# Altium project 2026MM.PrjPcb (part 10 of 10)
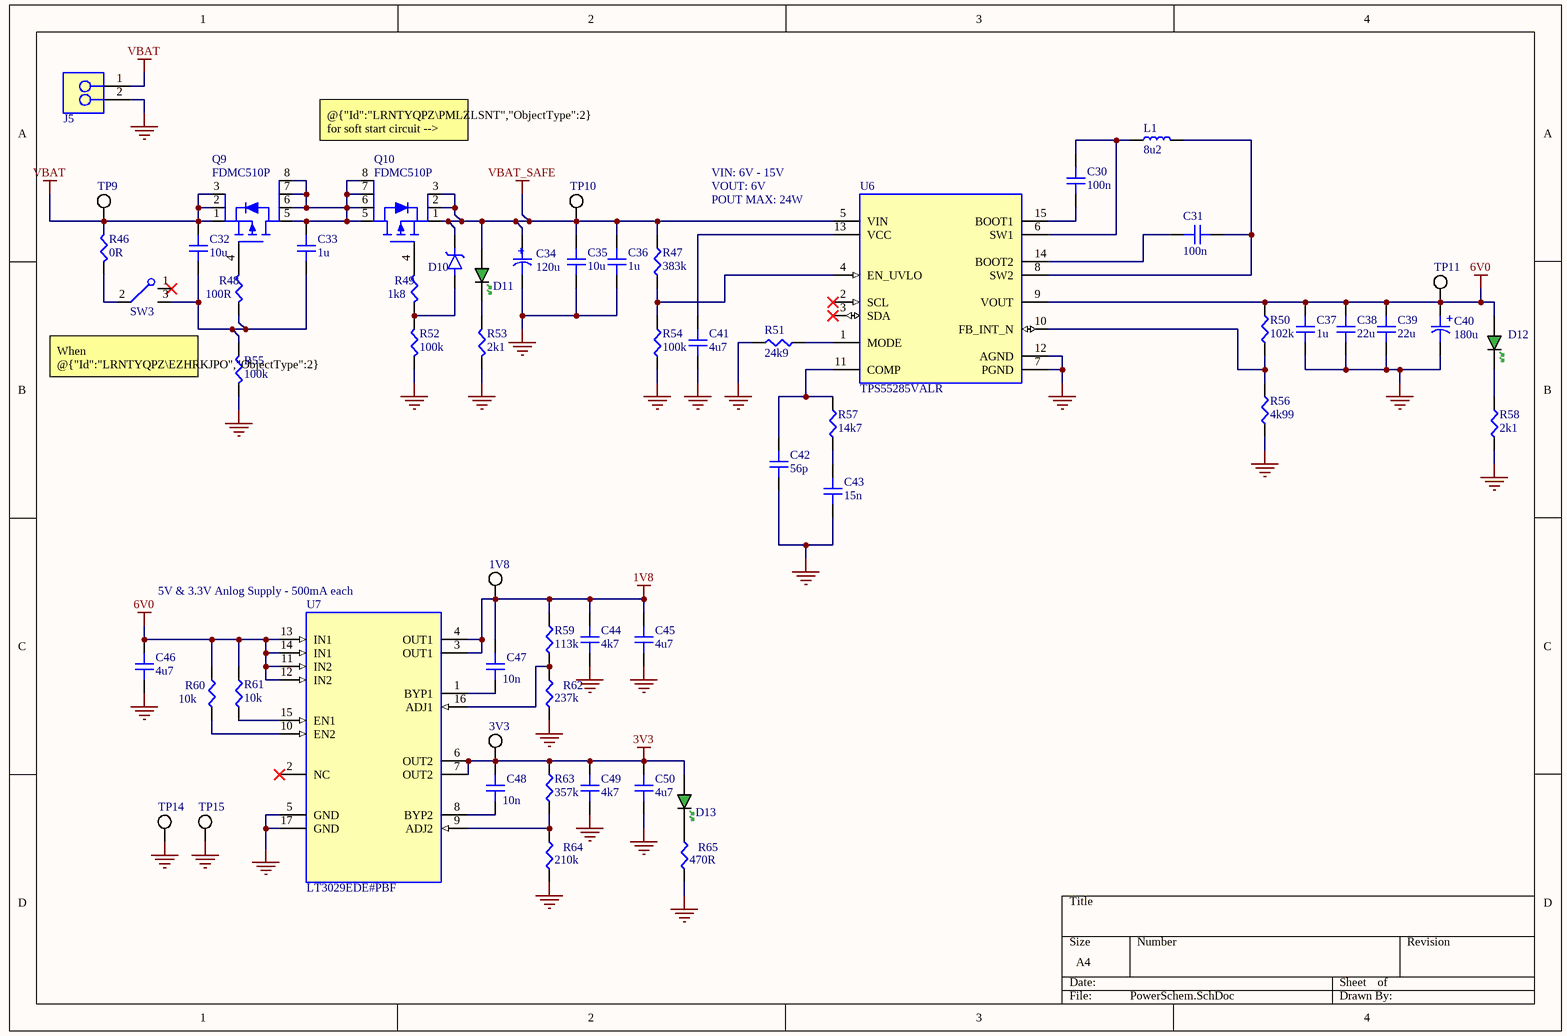
[diagram p10: PowerSchem.SchDoc]

## Sheet PowerSchem.SchDoc (continued)

### Library data of the parts (continued)
R60 R61 = RES: 100mW Thick Film Resistors ±100ppm/℃ ±1% 10kΩ 0603 Chip Resistor - Surface Mount ROHS; Manufacturer: Yageo Group; Manufacturer Part Number: RC0603FR-0710KL; Temperature Coefficient: 100ppm/°C; Voltage Rating: 75V; Voltage Rating (DC): 50V; Value: 10k; Supplier 1: Avnet; Supplier Part Number 1: RC0603FR-0710KL; RoHS: Compliant; Category: Chip SMD Resistors; Stock: 2520000; Pricing: 5000=0.00136, 10000=0.00132, 20000=0.00129, 40000=0.00126, 80000=0.00123 (USD); Case/Package: 0603; Case Code (Imperial): 0603; Case Code (Metric): 0603; China RoHS: Non-Compliant; Composition: Thick Film; Contact Plating: Tin; Depth: 800µm; Height: 450µm; Lead Free: Lead Free; Lead Pitch: 300µm; Length: 1.6mm; Lifecycle Status: Production; Max Operating Temperature: 155°C; Military Standard: Not; Min Operating Temperature: -55°C; Mounting Technology: Surface Mount; Pins: 2; Number of Terminals: 2; Packaging: Tape & Reel; Power Rating: 100mW; Radiation Hardening: No; REACH SVHC: Yes; Schedule B: 8533210045, 8533210045|8533210045|8533210045|8533210045|8533210045|8533210045|8533210045|8533210045|8533210045|8533210045|8533210045|8533210045|8533210045|8533210045|8533210045|8533210045|8533210045|8533210045|8533210045|8533210045|8533210045|8533210045|8533210045|85; Termination: SMD/SMT; Tolerance: 1%; Weight: 2.012816mg; Width: 800µm; Working Voltage: 75V; ComponentLink1URL: https://datasheet.octopart.com:443/RC0603FR-0710KL-Yageo-datasheet-175887523.pdf?src-supplier=IHS; ComponentLink1Description: https://datasheet.octopart.com:443/RC0603FR-0710KL-Yageo-datasheet-175887523.pdf?src-supplier=IHS; ComponentLink2URL: https://datasheet.octopart.com:443/RC0603FR-0710KL-Yageo-datasheet-103092701.pdf?src-supplier=Upverter; ComponentLink2Description: https://datasheet.octopart.com:443/RC0603FR-0710KL-Yageo-datasheet-103092701.pdf?src-supplier=Upverter; ComponentLink3URL: https://datasheet.octopart.com:443/RC0603FR-0710KL-Yageo-datasheet-98239111.pdf?src-supplier=Upverter; ComponentLink3Description: https://datasheet.octopart.com:443/RC0603FR-0710KL-Yageo-datasheet-98239111.pdf?src-supplier=Upverter; ComponentLink4URL: https://datasheet.octopart.com:443/RC0603FR-0710KL-Yageo-datasheet-141265859.pdf?src-supplier=Upverter; ComponentLink4Description: https://datasheet.octopart.com:443/RC0603FR-0710KL-Yageo-datasheet-141265859.pdf?src-supplier=Upverter; ComponentLink5URL: https://sigma.octopart.com:443/138820526/technical_drawing/Yageo-RC0603FR-0710KL.pdf?src-supplier=Upverter; ComponentLink5Description: https://sigma.octopart.com:443/138820526/technical_drawing/Yageo-RC0603FR-0710KL.pdf?src-supplier=Upverter; ComponentLink6URL: https://datasheet.octopart.com:443/RC0603FR-0710KL-Yageo-datasheet-8328172.pdf?src-supplier=Farnell; ComponentLink6Description: https://datasheet.octopart.com:443/RC0603FR-0710KL-Yageo-datasheet-8328172.pdf?src-supplier=Farnell; ComponentLink7URL: https://datasheet.octopart.com:443/RC0603FR-0710KL-Yageo-datasheet-13691069.pdf?src-supplier=Farnell; ComponentLink7Description: https://datasheet.octopart.com:443/RC0603FR-0710KL-Yageo-datasheet-13691069.pdf?src-supplier=Farnell; ComponentLink8URL: https://datasheet.octopart.com:443/RC0603FR-0710KL-Yageo-datasheet-62067350.pdf?src-supplier=element14+APAC; ComponentLink8Description: https://datasheet.octopart.com:443/RC0603FR-0710KL-Yageo-datasheet-62067350.pdf?src-supplier=element14+APAC; ComponentLink9URL: https://datasheet.octopart.com:443/RC0603FR-0710KL-Yageo-datasheet-17842380.pdf?src-supplier=element14+APAC; ComponentLink9Description: https://datasheet.octopart.com:443/RC0603FR-0710KL-Yageo-datasheet-17842380.pdf?src-supplier=element14+APAC; ComponentLink10URL: https://datasheet.octopart.com:443/RC0603FR-0710KL-Yageo-datasheet-15599030.pdf?src-supplier=Future+Electronics; ComponentLink10Description: https://datasheet.octopart.com:443/RC0603FR-0710KL-Yageo-datasheet-15599030.pdf?src-supplier=Future+Electronics; ComponentLink11URL: https://datasheet.octopart.com:443/RC0603FR-0710KL-Yageo-Group-datasheet-176638170.pdf?src-supplier=Future+Electronics; ComponentLink11Description: https://datasheet.octopart.com:443/RC0603FR-0710KL-Yageo-Group-datasheet-176638170.pdf?src-supplier=Future+Electronics; ComponentLink12URL: https://datasheet.octopart.com:443/RC0603FR-0710KL-Yageo-datasheet-164759695.pdf?src-supplier=Future+Electronics; ComponentLink12Description: https://datasheet.octopart.com:443/RC0603FR-0710KL-Yageo-datasheet-164759695.pdf?src-supplier=Future+Electronics; ComponentLink13URL: https://datasheet.octopart.com:443/RC0603FR-0710KL-Yageo-datasheet-127823281.pdf?src-supplier=Future+Electronics; ComponentLink13Description: https://datasheet.octopart.com:443/RC0603FR-0710KL-Yageo-datasheet-127823281.pdf?src-supplier=Future+Electronics; ComponentLink14URL: https://datasheet.octopart.com:443/RC0603FR-0710KL-Yageo-datasheet-137700087.pdf?src-supplier=Future+Electronics; ComponentLink14Description: https://datasheet.octopart.com:443/RC0603FR-0710KL-Yageo-datasheet-137700087.pdf?src-supplier=Future+Electronics; ComponentLink15URL: https://datasheet.octopart.com:443/RC0603FR-0710KL-Yageo-datasheet-27584510.pdf?src-supplier=Future+Electronics; ComponentLink15Description: https://datasheet.octopart.com:443/RC0603FR-0710KL-Yageo-datasheet-27584510.pdf?src-supplier=Future+Electronics; ComponentLink16URL: https://datasheet.octopart.com:443/RC0603FR-0710KL-Yageo-datasheet-8324193.pdf?src-supplier=Future+Electronics; ComponentLink16Description: https://datasheet.octopart.com:443/RC0603FR-0710KL-Yageo-datasheet-8324193.pdf?src-supplier=Future+Electronics; ComponentLink17URL: https://datasheet.octopart.com:443/RC0603FR-0710KL-Yageo-datasheet-12596169.pdf?src-supplier=Newark; ComponentLink17Description: https://datasheet.octopart.com:443/RC0603FR-0710KL-Yageo-datasheet-12596169.pdf?src-supplier=Newark; ComponentLink18URL: https://datasheet.octopart.com:443/RC0603FR-0710KL-Yageo-datasheet-503470.pdf?src-supplier=Newark; ComponentLink18Description: https://datasheet.octopart.com:443/RC0603FR-0710KL-Yageo-datasheet-503470.pdf?src-supplier=Newark; ComponentLink19URL: https://datasheet.octopart.com:443/RC0603FR-0710KL-Yageo-datasheet-34211833.pdf?src-supplier=Newark; ComponentLink19Description: https://datasheet.octopart.com:443/RC0603FR-0710KL-Yageo-datasheet-34211833.pdf?src-supplier=Newark; ComponentLink20URL: https://datasheet.octopart.com:443/RC0603FR-0710KL-Yageo-datasheet-79472498.pdf?src-supplier=Megastar; ComponentLink20Description: https://datasheet.octopart.com:443/RC0603FR-0710KL-Yageo-datasheet-79472498.pdf?src-supplier=Megastar; ComponentLink21URL: https://datasheet.octopart.com/RC0603FR-0710KL-Yageo-datasheet-73766026.pdf; ComponentLink21Description: https://datasheet.octopart.com/RC0603FR-0710KL-Yageo-datasheet-73766026.pdf; ComponentLink22URL: https://datasheet.octopart.com:443/RC0603FR-0710KL-Yageo-datasheet-118562.pdf?src-supplier=DigiKey; ComponentLink22Description: https://datasheet.octopart.com:443/RC0603FR-0710KL-Yageo-datasheet-118562.pdf?src-supplier=DigiKey; ComponentLink23URL: http://sigma.octopart.com:80/conflict_mineral_statement/Yageo-company-3.pdf?src-supplier=Compliance+Statements; ComponentLink23Description: http://sigma.octopart.com:80/conflict_mineral_statement/Yageo-company-3.pdf?src-supplier=Compliance+Statements; ComponentLink24URL: http://sigma.octopart.com:80/rohs_statement/Yageo-company-2.pdf?src-supplier=Compliance+Statements; ComponentLink24Description: http://sigma.octopart.com:80/rohs_statement/Yageo-company-2.pdf?src-supplier=Compliance+Statements
R62 = RES: Res Thick Film 0603 237K Ohm 1% 0.1W(1/10W) ±100ppm/C Pad SMD Automotive T/R; Manufacturer: Yageo Group; Manufacturer Part Number: AC0603FR-07237KL; Max Power Dissipation: 100mW; Temperature Coefficient: 100ppm/°C; Voltage Rating: 75V; Value: 237k; Supplier 1: Avnet; Supplier Part Number 1: 59AK3101; RoHS: Compliant; Category: Chip SMD Resistors; Stock: 9242; Pricing: 1=0.103, 25=0.008 (USD); Case/Package: 0603; China RoHS: Non-Compliant; Composition: Thick Film; Features: Automotive AEC-Q200, Moisture Resistant; Height: 450µm; Length: 1.6mm; Lifecycle Status: Production; Max Operating Temperature: 155°C; Min Operating Temperature: -55°C; Mounting Technology: Surface Mount; Number of Terminals: 2; Number of Terminations: 2; Packaging: Tape & Reel; Power Rating: 100mW; Ratings: AEC-Q200; REACH SVHC: Yes; Tolerance: 1%; Width: 800µm; Working Voltage: 75V; ComponentLink1URL: https://datasheet.octopart.com:443/AC0603FR-07237KL-Yageo-datasheet-182189377.pdf?src-supplier=IHS; ComponentLink1Description: https://datasheet.octopart.com:443/AC0603FR-07237KL-Yageo-datasheet-182189377.pdf?src-supplier=IHS; ComponentLink2URL: https://datasheet.octopart.com:443/AC0603FR-07237KL-Yageo-datasheet-86786639.pdf?src-supplier=Upverter; ComponentLink2Description: https://datasheet.octopart.com:443/AC0603FR-07237KL-Yageo-datasheet-86786639.pdf?src-supplier=Upverter; ComponentLink3URL: https://datasheet.octopart.com:443/AC0603FR-07237KL-Yageo-datasheet-178509465.pdf?src-supplier=Farnell; ComponentLink3Description: https://datasheet.octopart.com:443/AC0603FR-07237KL-Yageo-datasheet-178509465.pdf?src-supplier=Farnell; ComponentLink4URL: https://datasheet.octopart.com/AC0603FR-07237KL-Yageo-datasheet-12512238.pdf; ComponentLink4Description: https://datasheet.octopart.com/AC0603FR-07237KL-Yageo-datasheet-12512238.pdf; ComponentLink5URL: http://sigma.octopart.com:80/conflict_mineral_statement/Yageo-company-3.pdf?src-supplier=Compliance+Statements; ComponentLink5Description: http://sigma.octopart.com:80/conflict_mineral_statement/Yageo-company-3.pdf?src-supplier=Compliance+Statements; ComponentLink6URL: http://sigma.octopart.com:80/rohs_statement/Yageo-company-2.pdf?src-supplier=Compliance+Statements; ComponentLink6Description: http://sigma.octopart.com:80/rohs_statement/Yageo-company-2.pdf?src-supplier=Compliance+Statements
R63 = RES: Fixed Resistor, Thin Film, 0.1W, 357000ohm, 75V, 0.1% +/-Tol, 25ppm/Cel, Surface Mount, 0603; Manufacturer: Yageo Group; Manufacturer Part Number: RT0603BRD07357KL; Max Power Dissipation: 100mW; Temperature Coefficient: 25ppm/°C; Value: 357k; Supplier 1: DigiKey; Supplier Part Number 1: 13-RT0603BRD07357KLCT-ND; RoHS: Compliant; Category: Chip SMD Resistors; Stock: 5405; Pricing: 1=0.1, 10=0.063, 25=0.0584, 50=0.055, 100=0.0519, 250=0.0482, 500=0.04558, 1000=0.04319 (USD); Case/Package: 0603; Case Code (Imperial): 0603; Case Code (Metric): 1608; China RoHS: Non-Compliant; Composition: Thin Film; Features: Moisture Resistant; Height: 450µm; Length: 1.6mm; Lifecycle Status: Production; Max Operating Temperature: 155°C; Min Operating Temperature: -55°C; Mounting Technology: Surface Mount; Number of Terminals: 2; Number of Terminations: 2; Packaging: Tape & Reel; Power Rating: 100mW; REACH SVHC: Yes; Termination: SMD/SMT; Tolerance: 0.1%; Voltage Rating: 75V; Width: 800µm; Working Voltage: 75V; ComponentLink1URL: https://datasheet.octopart.com:443/RT0603BRD07357KL-Yageo-datasheet-176402239.pdf?src-supplier=Future+Electronics; ComponentLink1Description: https://datasheet.octopart.com:443/RT0603BRD07357KL-Yageo-datasheet-176402239.pdf?src-supplier=Future+Electronics; ComponentLink2URL: https://datasheet.octopart.com:443/RT0603BRD07357KL-Yageo-datasheet-169971040.pdf?src-supplier=Future+Electronics; ComponentLink2Description: https://datasheet.octopart.com:443/RT0603BRD07357KL-Yageo-datasheet-169971040.pdf?src-supplier=Future+Electronics; ComponentLink3URL: https://datasheet.octopart.com:443/RT0603BRD07357KL-Yageo-datasheet-96443642.pdf?src-supplier=Upverter; ComponentLink3Description: https://datasheet.octopart.com:443/RT0603BRD07357KL-Yageo-datasheet-96443642.pdf?src-supplier=Upverter; ComponentLink4URL: https://datasheet.octopart.com/RT0603BRD07357KL-Yageo-datasheet-86813807.pdf; ComponentLink4Description: https://datasheet.octopart.com/RT0603BRD07357KL-Yageo-datasheet-86813807.pdf; ComponentLink5URL: http://sigma.octopart.com:80/conflict_mineral_statement/Yageo-company-3.pdf?src-supplier=Compliance+Statements; ComponentLink5Description: http://sigma.octopart.com:80/conflict_mineral_statement/Yageo-company-3.pdf?src-supplier=Compliance+Statements; ComponentLink6URL: http://sigma.octopart.com:80/rohs_statement/Yageo-company-2.pdf?src-supplier=Compliance+Statements; ComponentLink6Description: http://sigma.octopart.com:80/rohs_statement/Yageo-company-2.pdf?src-supplier=Compliance+Statements
R64 = RES: 100mW Thick Film Resistors 75V ±100ppm/℃ ±1% 210kΩ 0603 Chip Resistor - Surface Mount ROHS; Manufacturer: Yageo Group; Manufacturer Part Number: RC0603FR-07210KL; Temperature Coefficient: 100ppm/°C; Voltage Rating (DC): 50V; Value: 210k; Supplier 1: Avnet; Supplier Part Number 1: 49AK1945; RoHS: Compliant; Category: Chip SMD Resistors; Stock: 2692; Pricing: 1=0.103 (USD); Case/Package: 0603; Case Code (Imperial): 0603; China RoHS: Non-Compliant; Composition: Thick Film; Depth: 800µm; Features: Moisture Resistant; Height: 450µm; Lead Free: Lead Free; Length: 1.6mm; Lifecycle Status: Production; Max Operating Temperature: 155°C; Max Power Dissipation: 100mW; Min Operating Temperature: -55°C; Mounting Technology: Surface Mount; Number of Terminals: 2; Number of Terminations: 2; Packaging: Tape & Reel; Power Rating: 100mW; REACH SVHC: Yes; Schedule B: 8533210045, 8533210045|8533210045|8533210045|8533210045|8533210045; Termination: SMD/SMT; Tolerance: 1%; Voltage Rating: 75V; Width: 800µm; Working Voltage: 75V; ComponentLink1URL: https://datasheet.octopart.com:443/RC0603FR-07210KL-Yageo-datasheet-175887523.pdf?src-supplier=Newark; ComponentLink1Description: https://datasheet.octopart.com:443/RC0603FR-07210KL-Yageo-datasheet-175887523.pdf?src-supplier=Newark; ComponentLink2URL: https://datasheet.octopart.com:443/RC0603FR-07210KL-Yageo-datasheet-103092701.pdf?src-supplier=Upverter; ComponentLink2Description: https://datasheet.octopart.com:443/RC0603FR-07210KL-Yageo-datasheet-103092701.pdf?src-supplier=Upverter; ComponentLink3URL: https://datasheet.octopart.com:443/RC0603FR-07210KL-Yageo-Group-datasheet-189192902.pdf?src-supplier=TME; ComponentLink3Description: https://datasheet.octopart.com:443/RC0603FR-07210KL-Yageo-Group-datasheet-189192902.pdf?src-supplier=TME; ComponentLink4URL: https://datasheet.octopart.com:443/RC0603FR-07210KL-Yageo-Group-datasheet-176638170.pdf?src-supplier=Future+Electronics; ComponentLink4Description: https://datasheet.octopart.com:443/RC0603FR-07210KL-Yageo-Group-datasheet-176638170.pdf?src-supplier=Future+Electronics; ComponentLink5URL: https://datasheet.octopart.com:443/RC0603FR-07210KL-Yageo-datasheet-164759695.pdf?src-supplier=Future+Electronics; ComponentLink5Description: https://datasheet.octopart.com:443/RC0603FR-07210KL-Yageo-datasheet-164759695.pdf?src-supplier=Future+Electronics; ComponentLink6URL: https://datasheet.octopart.com:443/RC0603FR-07210KL-Yageo-datasheet-137700087.pdf?src-supplier=Future+Electronics; ComponentLink6Description: https://datasheet.octopart.com:443/RC0603FR-07210KL-Yageo-datasheet-137700087.pdf?src-supplier=Future+Electronics; ComponentLink7URL: https://datasheet.octopart.com:443/RC0603FR-07210KL-Yageo-datasheet-15599030.pdf?src-supplier=Future+Electronics; ComponentLink7Description: https://datasheet.octopart.com:443/RC0603FR-07210KL-Yageo-datasheet-15599030.pdf?src-supplier=Future+Electronics; ComponentLink8URL: https://datasheet.octopart.com:443/RC0603FR-07210KL-Yageo-datasheet-12596169.pdf?src-supplier=Future+Electronics; ComponentLink8Description: https://datasheet.octopart.com:443/RC0603FR-07210KL-Yageo-datasheet-12596169.pdf?src-supplier=Future+Electronics; ComponentLink9URL: https://datasheet.octopart.com:443/RC0603FR-07210KL-Yageo-datasheet-8328172.pdf?src-supplier=Future+Electronics; ComponentLink9Description: https://datasheet.octopart.com:443/RC0603FR-07210KL-Yageo-datasheet-8328172.pdf?src-supplier=Future+Electronics; ComponentLink10URL: https://datasheet.octopart.com:443/RC0603FR-07210KL-Yageo-datasheet-79472498.pdf?src-supplier=Megastar; ComponentLink10Description: https://datasheet.octopart.com:443/RC0603FR-07210KL-Yageo-datasheet-79472498.pdf?src-supplier=Megastar; ComponentLink11URL: https://datasheet.octopart.com/RC0603FR-07210KL-Yageo-datasheet-73766026.pdf; ComponentLink11Description: https://datasheet.octopart.com/RC0603FR-07210KL-Yageo-datasheet-73766026.pdf; ComponentLink12URL: https://datasheet.octopart.com:443/RC0603FR-07210KL-Yageo-datasheet-118562.pdf?src-supplier=DigiKey; ComponentLink12Description: https://datasheet.octopart.com:443/RC0603FR-07210KL-Yageo-datasheet-118562.pdf?src-supplier=DigiKey; ComponentLink13URL: http://sigma.octopart.com:80/conflict_mineral_statement/Yageo-company-3.pdf?src-supplier=Compliance+Statements; ComponentLink13Description: http://sigma.octopart.com:80/conflict_mineral_statement/Yageo-company-3.pdf?src-supplier=Compliance+Statements; ComponentLink14URL: http://sigma.octopart.com:80/rohs_statement/Yageo-company-2.pdf?src-supplier=Compliance+Statements; ComponentLink14Description: http://sigma.octopart.com:80/rohs_statement/Yageo-company-2.pdf?src-supplier=Compliance+Statements
R65 = RES: Res Thick Film 0603 470 Ohm 1% 0.1W(1/10W) ±100ppm/C Pad SMD T/R; Manufacturer: Yageo Group; Manufacturer Part Number: RC0603FR-07470RL; Impedance: 50Ω; Max Power Dissipation: 100mW; Temperature Coefficient: 100ppm/°C; Voltage Rating: 75V; Voltage Rating (DC): 50V; Value: 470R; Supplier 1: Avnet; Supplier Part Number 1: RC0603FR-07470RL; RoHS: Compliant; Category: Chip SMD Resistors; Stock: 510000; Pricing: 5000=0.00137, 10000=0.00137, 20000=0.00136, 40000=0.00135, 80000=0.00134 (USD); Case/Package: 0603; Case Code (Imperial): 0603; Case Code (Metric): 0603; China RoHS: Non-Compliant; Composition: Thick Film; Contact Material: Brass; Contact Plating: Gold; Depth: 800µm; Features: Moisture Resistant; Height: 450µm; Lead Free: Lead Free; Length: 1.6mm; Lifecycle Status: Production; Max Operating Temperature: 155°C; Military Standard: Not; Min Operating Temperature: -55°C; Mounting Technology: Surface Mount; Pins: 2; Number of Terminals: 2; Number of Terminations: 2; Packaging: Tape and Reel; Power Rating: 100mW; Radiation Hardening: No; REACH SVHC: Yes; Schedule B: 8533210045, 8533210045|8533210045, 8533210045|8533210045|8533210045, 8533210045|8533210045|8533210045|8533210045; Termination: SMD/SMT; Tolerance: 1%; Width: 800µm; Working Voltage: 75V; ComponentLink1URL: https://datasheet.octopart.com:443/RC0603FR-07470RL-Yageo-datasheet-175887523.pdf?src-supplier=Newark; ComponentLink1Description: https://datasheet.octopart.com:443/RC0603FR-07470RL-Yageo-datasheet-175887523.pdf?src-supplier=Newark; ComponentLink2URL: https://datasheet.octopart.com:443/RC0603FR-07470RL-Yageo-datasheet-8328172.pdf?src-supplier=Newark; ComponentLink2Description: https://datasheet.octopart.com:443/RC0603FR-07470RL-Yageo-datasheet-8328172.pdf?src-supplier=Newark; ComponentLink3URL: https://datasheet.octopart.com:443/RC0603FR-07470RL-Yageo-Group-datasheet-190051977.pdf?src-supplier=Newark; ComponentLink3Description: https://datasheet.octopart.com:443/RC0603FR-07470RL-Yageo-Group-datasheet-190051977.pdf?src-supplier=Newark; ComponentLink4URL: https://datasheet.octopart.com:443/RC0603FR-07470RL-Yageo-datasheet-12596169.pdf?src-supplier=Newark; ComponentLink4Description: https://datasheet.octopart.com:443/RC0603FR-07470RL-Yageo-datasheet-12596169.pdf?src-supplier=Newark; ComponentLink5URL: https://datasheet.octopart.com:443/RC0603FR-07470RL-Yageo-datasheet-103092701.pdf?src-supplier=Upverter; ComponentLink5Description: https://datasheet.octopart.com:443/RC0603FR-07470RL-Yageo-datasheet-103092701.pdf?src-supplier=Upverter; ComponentLink6URL: https://datasheet.octopart.com:443/RC0603FR-07470RL-Yageo-datasheet-98239111.pdf?src-supplier=Upverter; ComponentLink6Description: https://datasheet.octopart.com:443/RC0603FR-07470RL-Yageo-datasheet-98239111.pdf?src-supplier=Upverter; ComponentLink7URL: https://datasheet.octopart.com:443/RC0603FR-07470RL-Yageo-datasheet-34211833.pdf?src-supplier=element14+APAC; ComponentLink7Description: https://datasheet.octopart.com:443/RC0603FR-07470RL-Yageo-datasheet-34211833.pdf?src-supplier=element14+APAC; ComponentLink8URL: https://datasheet.octopart.com:443/RC0603FR-07470RL-Yageo-datasheet-17842380.pdf?src-supplier=element14+APAC; ComponentLink8Description: https://datasheet.octopart.com:443/RC0603FR-07470RL-Yageo-datasheet-17842380.pdf?src-supplier=element14+APAC; ComponentLink9URL: https://datasheet.octopart.com:443/RC0603FR-07470RL-Yageo-datasheet-62067350.pdf?src-supplier=Farnell; ComponentLink9Description: https://datasheet.octopart.com:443/RC0603FR-07470RL-Yageo-datasheet-62067350.pdf?src-supplier=Farnell; ComponentLink10URL: https://datasheet.octopart.com:443/RC0603FR-07470RL-Yageo-datasheet-13691069.pdf?src-supplier=Farnell; ComponentLink10Description: https://datasheet.octopart.com:443/RC0603FR-07470RL-Yageo-datasheet-13691069.pdf?src-supplier=Farnell; ComponentLink11URL: https://datasheet.octopart.com:443/RC0603FR-07470RL-Yageo-Group-datasheet-176638170.pdf?src-supplier=Future+Electronics; ComponentLink11Description: https://datasheet.octopart.com:443/RC0603FR-07470RL-Yageo-Group-datasheet-176638170.pdf?src-supplier=Future+Electronics; ComponentLink12URL: https://datasheet.octopart.com:443/RC0603FR-07470RL-Yageo-datasheet-164759695.pdf?src-supplier=Future+Electronics; ComponentLink12Description: https://datasheet.octopart.com:443/RC0603FR-07470RL-Yageo-datasheet-164759695.pdf?src-supplier=Future+Electronics; ComponentLink13URL: https://datasheet.octopart.com:443/RC0603FR-07470RL-Yageo-datasheet-137700087.pdf?src-supplier=Future+Electronics; ComponentLink13Description: https://datasheet.octopart.com:443/RC0603FR-07470RL-Yageo-datasheet-137700087.pdf?src-supplier=Future+Electronics; ComponentLink14URL: https://datasheet.octopart.com:443/RC0603FR-07470RL-Yageo-datasheet-127823281.pdf?src-supplier=Future+Electronics; ComponentLink14Description: https://datasheet.octopart.com:443/RC0603FR-07470RL-Yageo-datasheet-127823281.pdf?src-supplier=Future+Electronics; ComponentLink15URL: https://datasheet.octopart.com:443/RC0603FR-07470RL-Yageo-datasheet-27584510.pdf?src-supplier=Future+Electronics; ComponentLink15Description: https://datasheet.octopart.com:443/RC0603FR-07470RL-Yageo-datasheet-27584510.pdf?src-supplier=Future+Electronics; ComponentLink16URL: https://datasheet.octopart.com:443/RC0603FR-07470RL-Yageo-datasheet-15599030.pdf?src-supplier=Future+Electronics; ComponentLink16Description: https://datasheet.octopart.com:443/RC0603FR-07470RL-Yageo-datasheet-15599030.pdf?src-supplier=Future+Electronics; ComponentLink17URL: https://datasheet.octopart.com:443/RC0603FR-07470RL-Yageo-datasheet-503470.pdf?src-supplier=Future+Electronics; ComponentLink17Description: https://datasheet.octopart.com:443/RC0603FR-07470RL-Yageo-datasheet-503470.pdf?src-supplier=Future+Electronics; ComponentLink18URL: https://datasheet.octopart.com:443/RC0603FR-07470RL-Yageo-datasheet-79472498.pdf?src-supplier=Megastar; ComponentLink18Description: https://datasheet.octopart.com:443/RC0603FR-07470RL-Yageo-datasheet-79472498.pdf?src-supplier=Megastar; ComponentLink19URL: https://datasheet.octopart.com/RC0603FR-07470RL-Yageo-datasheet-73766026.pdf; ComponentLink19Description: https://datasheet.octopart.com/RC0603FR-07470RL-Yageo-datasheet-73766026.pdf; ComponentLink20URL: https://datasheet.octopart.com:443/RC0603FR-07470RL-Yageo-datasheet-118562.pdf?src-supplier=DigiKey; ComponentLink20Description: https://datasheet.octopart.com:443/RC0603FR-07470RL-Yageo-datasheet-118562.pdf?src-supplier=DigiKey; ComponentLink21URL: http://sigma.octopart.com:80/conflict_mineral_statement/Yageo-company-3.pdf?src-supplier=Compliance+Statements; ComponentLink21Description: http://sigma.octopart.com:80/conflict_mineral_statement/Yageo-company-3.pdf?src-supplier=Compliance+Statements; ComponentLink22URL: http://sigma.octopart.com:80/rohs_statement/Yageo-company-2.pdf?src-supplier=Compliance+Statements; ComponentLink22Description: http://sigma.octopart.com:80/rohs_statement/Yageo-company-2.pdf?src-supplier=Compliance+Statements
SW3 = SW_SPDT: Switch Slide ON ON SPDT Side Slide 0.1A 12VDC 10000Cycle PC Pins Thru-Hole Bulk; Manufacturer: C&K Components; Manufacturer Part Number: OS102011MA1QN1; Actuator Length: 3.9878mm; Actuator Material: Polyoxymethylene; Body Material: Tin; Contact Current Rating: 100mA; Contact Resistance: 20mΩ; Contact Style: Non-Shorting; Dielectric Material: Phenolic; Electrical Life: 10kcycles; Insulation Resistance: 100MΩ; Max Voltage Rating (DC): 12V; Number of Positions: 2; Switch Function: On-On; Switch Travel: 2mm; Supplier 1: Sager Electronics; Supplier Part Number 1: OS102011MA1QN1; RoHS: Compliant; Category: Slide Switches; Stock: 944; Pricing: 1=0.3589, 449=0.3179, 1124=0.3134, 2247=0.2967, 4494=0.2871, 8989=0.2781 (USD); Color: Black; Contact Material: Brass; Contact Plating: Silver; Current Rating: 100mA; Depth: 8.4mm; Export Control Classification Number (ECCN) Code: EAR99; Height: 4.7mm; Housing Material: Resin; Harmonized Tariff Schedule (HTS) Code: 8536.50.90.50; Introduction Date: 2006-02-08; Lead Free: Lead Free; Length: 8.6mm; Lifecycle Status: Production; Max Current Rating: 100mA; Max Operating Temperature: 70°C; Mechanical Life: 10kcycles; Min Operating Temperature: -10°C; Mounting Technology: Brackets, PCB, Through Hole; Orientation: Right Angle; Packaging: Bulk; Radiation Hardening: No; REACH SVHC: Yes; Terminal Material: Brass; Termination: PC Pins; Throw Configuration: SPDT; Voltage Rating (DC): 12V; Width: 4.4mm; ComponentLink1URL: https://datasheet.octopart.com:443/OS102011MA1QN1-C%26K-Components-datasheet-165712316.pdf?src-supplier=IHS; ComponentLink1Description: https://datasheet.octopart.com:443/OS102011MA1QN1-C%26K-Components-datasheet-165712316.pdf?src-supplier=IHS; ComponentLink2URL: https://datasheet.octopart.com:443/OS102011MA1QN1-C%26K-Components-datasheet-9645547.pdf?src-supplier=IHS; ComponentLink2Description: https://datasheet.octopart.com:443/OS102011MA1QN1-C%26K-Components-datasheet-9645547.pdf?src-supplier=IHS; ComponentLink3URL: https://datasheet.octopart.com:443/OS102011MA1QN1-C%26K-Components-datasheet-100062965.pdf?src-supplier=Upverter; ComponentLink3Description: https://datasheet.octopart.com:443/OS102011MA1QN1-C%26K-Components-datasheet-100062965.pdf?src-supplier=Upverter; ComponentLink4URL: https://datasheet.octopart.com:443/OS102011MA1QN1-C%26K-Components-datasheet-67873706.pdf?src-supplier=Upverter; ComponentLink4Description: https://datasheet.octopart.com:443/OS102011MA1QN1-C%26K-Components-datasheet-67873706.pdf?src-supplier=Upverter; ComponentLink5URL: https://datasheet.octopart.com:443/OS102011MA1QN1-C%26K-Components-datasheet-77351947.pdf?src-supplier=Electro+Sonic; ComponentLink5Description: https://datasheet.octopart.com:443/OS102011MA1QN1-C%26K-Components-datasheet-77351947.pdf?src-supplier=Electro+Sonic; ComponentLink6URL: https://datasheet.octopart.com:443/OS102011MA1QN1-C%26K-Components-datasheet-142755260.pdf?src-supplier=Electro+Sonic; ComponentLink6Description: https://datasheet.octopart.com:443/OS102011MA1QN1-C%26K-Components-datasheet-142755260.pdf?src-supplier=Electro+Sonic; ComponentLink7URL: https://datasheet.octopart.com:443/OS102011MA1QN1-C%26K-Components-datasheet-44395687.pdf?src-supplier=Electro+Sonic; ComponentLink7Description: https://datasheet.octopart.com:443/OS102011MA1QN1-C%26K-Components-datasheet-44395687.pdf?src-supplier=Electro+Sonic; ComponentLink8URL: https://datasheet.octopart.com:443/OS102011MA1QN1-C%26K-Components-datasheet-14434867.pdf?src-supplier=Electro+Sonic; ComponentLink8Description: https://datasheet.octopart.com:443/OS102011MA1QN1-C%26K-Components-datasheet-14434867.pdf?src-supplier=Electro+Sonic; ComponentLink9URL: https://datasheet.octopart.com:443/OS102011MA1QN1-C%26K-Components-datasheet-13440078.pdf?src-supplier=element14+APAC; ComponentLink9Description: https://datasheet.octopart.com:443/OS102011MA1QN1-C%26K-Components-datasheet-13440078.pdf?src-supplier=element14+APAC; ComponentLink10URL: https://datasheet.octopart.com:443/OS102011MA1QN1-C%26K-Components-datasheet-150821956.pdf?src-supplier=Burklin+Elektronik; ComponentLink10Description: https://datasheet.octopart.com:443/OS102011MA1QN1-C%26K-Components-datasheet-150821956.pdf?src-supplier=Burklin+Elektronik; ComponentLink11URL: https://datasheet.octopart.com:443/OS102011MA1QN1-C%26K-Components-datasheet-24578929.pdf?src-supplier=Future+Electronics; ComponentLink11Description: https://datasheet.octopart.com:443/OS102011MA1QN1-C%26K-Components-datasheet-24578929.pdf?src-supplier=Future+Electronics; ComponentLink12URL: https://datasheet.octopart.com:443/OS102011MA1QN1-C%26K-Components-datasheet-62111170.pdf?src-supplier=Future+Electronics; ComponentLink12Description: https://datasheet.octopart.com:443/OS102011MA1QN1-C%26K-Components-datasheet-62111170.pdf?src-supplier=Future+Electronics; ComponentLink13URL: https://datasheet.octopart.com:443/OS102011MA1QN1-C%26K-Components-datasheet-7283719.pdf?src-supplier=Jameco; ComponentLink13Description: https://datasheet.octopart.com:443/OS102011MA1QN1-C%26K-Components-datasheet-7283719.pdf?src-supplier=Jameco; ComponentLink14URL: https://datasheet.octopart.com:443/OS102011MA1QN1-C%26K-Components-datasheet-62112609.pdf?src-supplier=RS+(Formerly+Allied+Electronics); ComponentLink14Description: https://datasheet.octopart.com:443/OS102011MA1QN1-C%26K-Components-datasheet-62112609.pdf?src-supplier=RS+(Formerly+Allied+Electronics); ComponentLink15URL: https://datasheet.octopart.com:443/OS102011MA1QN1-ITT-datasheet-542779.pdf?src-supplier=Farnell; ComponentLink15Description: https://datasheet.octopart.com:443/OS102011MA1QN1-ITT-datasheet-542779.pdf?src-supplier=Farnell; ComponentLink16URL: http://sigma.octopart.com:80/reach_statement/ITT-company-18.pdf?src-supplier=Compliance+Statements; ComponentLink16Description: http://sigma.octopart.com:80/reach_statement/ITT-company-18.pdf?src-supplier=Compliance+Statements
TP9-TP15 = TP
U6 = XTPS55285VALR: 22V 8A buck-boost converter with I²C interface 15-WQFN-HR -40 to 125; Manufacturer_Name: Texas Instruments; Manufacturer Lifecycle Status: ACTIVE; TYPE: TYPE; RefDes: RefDes; Copyright: Copyright (C) 2026 Ultra Librarian. All rights reserved.; Manufacturer_Part_Number: XTPS55285VALR; Datasheet: https://www.ti.com/lit/gpn/tps55285; Supplier 1: DigiKey; Supplier Part Number 1: 296-TPS55285VALRCT-ND; Manufacturer: Texas Instruments; Manufacturer Part Number: TPS55285VALR; RoHS: Compliant; Category: Voltage Regulators - Switching; Stock: 1651; Pricing: 1=4.03, 10=3.047, 25=2.8016, 100=2.5314, 250=2.4026, 500=2.32496, 1000=2.26108 (USD); Height: 0m; Length: 2.5mm; Lifecycle Status: Production; Pins: 15; Thickness: 700µm; Topology: Buck-Boost; Width: 3.5mm; ComponentLink1URL: https://octopart.com:443/opatz8j6/c1?t=tixoSV1gCGqczMocm3I9OKrk8eaKkccHY9g_1ElVG9yucqZVouug_j8Q9OOTnJLvTijulg3rDwt1smdoN-zh07xMNjk_dhfSBkBT8Jkwjzp99TLWFXbbaK4hImVgzE0XFyBXxEvC-qoiY2OTt51xYy0xUbrWQOhaLO_eAozdfx7Rfu2m9J9MhF-17Y7dtTN3NXzLvJgQTEJUUtvNMDRG0FJZCJ29JLnkhbGy2axpQyizEj9FnGfVuPDqxeDNt-U0C-z41GSpYP9T8hdz_-kB1n1XgheAs6UpqiBEm9HzSwg2Lkv_dz2k3xcFx34LUQ3M2UELK1K55e4UrnCF5adijfSlu4bPcfDbhj7FzKH5uV6DMkG0dAiNO6wWqkfATbu_bIVVHTIWfw&src-supplier=Texas+Instruments; ComponentLink1Description: https://octopart.com:443/opatz8j6/c1?t=tixoSV1gCGqczMocm3I9OKrk8eaKkccHY9g_1ElVG9yucqZVouug_j8Q9OOTnJLvTijulg3rDwt1smdoN-zh07xMNjk_dhfSBkBT8Jkwjzp99TLWFXbbaK4hImVgzE0XFyBXxEvC-qoiY2OTt51xYy0xUbrWQOhaLO_eAozdfx7Rfu2m9J9MhF-17Y7dtTN3NXzLvJgQTEJUUtvNMDRG0FJZCJ29JLnkhbGy2axpQyizEj9FnGfVuPDqxeDNt-U0C-z41GSpYP9T8hdz_-kB1n1XgheAs6UpqiBEm9HzSwg2Lkv_dz2k3xcFx34LUQ3M2UELK1K55e4UrnCF5adijfSlu4bPcfDbhj7FzKH5uV6DMkG0dAiNO6wWqkfATbu_bIVVHTIWfw&src-supplier=Texas+Instruments; ComponentLink2URL: http://sigma.octopart.com:80/reach_statement/Texas-Instruments-company-64.pdf?src-supplier=Compliance+Statements; ComponentLink2Description: http://sigma.octopart.com:80/reach_statement/Texas-Instruments-company-64.pdf?src-supplier=Compliance+Statements; ComponentLink3URL: http://sigma.octopart.com:80/conflict_mineral_statement/Texas-Instruments-company-63.pdf?src-supplier=Compliance+Statements; ComponentLink3Description: http://sigma.octopart.com:80/conflict_mineral_statement/Texas-Instruments-company-63.pdf?src-supplier=Compliance+Statements
U7 = LT3029EDE#PBF: LDO Regulator Pos 1.215V to 19.5V 0.5A 16-Pin DFN EP; Manufacturer: Analog Devices; Manufacturer Lifecycle Status: PRODUCTION; Current - Output 1: 500mA; Dropout Voltage: 300mV; Max Supply Voltage: 20V; Max Junction Temperature (Tj): 125°C; Min Current Limit: 520mA; Min Input Voltage: 1.8V; Number of Channels: 1; Number of Outputs: 2; Polarity: Positive; Supplier: Newark; Supplier Part Number: LT3029EDE#PBF; Manufacturer Part Number: LT3029EDE#PBF; RoHS: Compliant; Category: Voltage Regulators - Linear; Stock: 92; Pricing: 1=9.36, 10=7.28, 25=6.93, 50=6.57, 182=6.22, 273=6, 546=5.89 (USD); Case/Package: DFN; Current - Output 2: 500mA; Height: 800µm; Lifecycle Status: Production; Max Operating Temperature: 125°C; Min Operating Temperature: -40°C; Min Supply Voltage: 1.8V; Mounting Technology: Surface Mount; Pins: 16; Number of Regulators: 2; Output Current: 500mA; Output Voltage: 19.5V; REACH SVHC: No; Schedule B: 8542390000, 8542390000|8542390000|8542390000|8542390000|8542390000; Voltage - Output 1: 19.5V; Voltage - Output 2: 19.5V; ComponentLink1URL: https://datasheet.octopart.com:443/LT3029EDE%23PBF-Analog-Devices-datasheet-26569571.pdf?src-supplier=Upverter; ComponentLink1Description: https://datasheet.octopart.com:443/LT3029EDE%23PBF-Analog-Devices-datasheet-26569571.pdf?src-supplier=Upverter; ComponentLink2URL: https://datasheet.octopart.com:443/LT3029EDE%23PBF-Linear-Technology-datasheet-14357712.pdf?src-supplier=Upverter; ComponentLink2Description: https://datasheet.octopart.com:443/LT3029EDE%23PBF-Linear-Technology-datasheet-14357712.pdf?src-supplier=Upverter; ComponentLink3URL: https://octopart.com:443/opatz8j6/c1?t=qU3BsmE-v0Jwl642rgpeURTQc-MXELaRr_u9bXcgPBo5ECKnDr3SpqE_3OMW_c6eN0TJL6QtafTYwh-e5BLV3jFR2ItgjyRp6tBzPAhLxT7P6tVmFvJLAgY53LcrqwnWSr5pWjSewhzY24Ys5rC48ACBzjQlnxL-TzEJhgISzWrpJN502vrcjSldoLkOj7vuCMX0JStzoG2PEs55GreG1EwIeYH94fj7WwkgIHGyqyf9kv0SFsDCi5tyFECI8SeNJnQ7q4tfy9dkpJCLuotSVZSYa3oW6a2l-Z_ufdKKvwgUJGNOlxNS&src-supplier=Analog+Devices; ComponentLink3Description: https://octopart.com:443/opatz8j6/c1?t=qU3BsmE-v0Jwl642rgpeURTQc-MXELaRr_u9bXcgPBo5ECKnDr3SpqE_3OMW_c6eN0TJL6QtafTYwh-e5BLV3jFR2ItgjyRp6tBzPAhLxT7P6tVmFvJLAgY53LcrqwnWSr5pWjSewhzY24Ys5rC48ACBzjQlnxL-TzEJhgISzWrpJN502vrcjSldoLkOj7vuCMX0JStzoG2PEs55GreG1EwIeYH94fj7WwkgIHGyqyf9kv0SFsDCi5tyFECI8SeNJnQ7q4tfy9dkpJCLuotSVZSYa3oW6a2l-Z_ufdKKvwgUJGNOlxNS&src-supplier=Analog+Devices; ComponentLink4URL: https://datasheet.octopart.com:443/LT3029EDE%23PBF-Linear-Technology-datasheet-10850731.pdf?src-supplier=element14; ComponentLink4Description: https://datasheet.octopart.com:443/LT3029EDE%23PBF-Linear-Technology-datasheet-10850731.pdf?src-supplier=element14; ComponentLink5URL: https://datasheet.octopart.com:443/LT3029EDE%23PBF-Linear-Technology-datasheet-8618308.pdf?src-supplier=Farnell; ComponentLink5Description: https://datasheet.octopart.com:443/LT3029EDE%23PBF-Linear-Technology-datasheet-8618308.pdf?src-supplier=Farnell; ComponentLink6URL: https://datasheet.octopart.com:443/LT3029EDE%23PBF-Linear-Technology-datasheet-15919048.pdf?src-supplier=iiiC; ComponentLink6Description: https://datasheet.octopart.com:443/LT3029EDE%23PBF-Linear-Technology-datasheet-15919048.pdf?src-supplier=iiiC; ComponentLink7URL: https://sigma.octopart.com:443/57695931/technical_drawing/Linear-Technology-LT3029EDE%23PBF.pdf?src-supplier=Linear+Technology; ComponentLink7Description: https://sigma.octopart.com:443/57695931/technical_drawing/Linear-Technology-LT3029EDE%23PBF.pdf?src-supplier=Linear+Technology; ComponentLink8URL: http://sigma.octopart.com:80/conflict_mineral_statement/Analog-Devices-company-33.pdf?src-supplier=Compliance+Statements; ComponentLink8Description: http://sigma.octopart.com:80/conflict_mineral_statement/Analog-Devices-company-33.pdf?src-supplier=Compliance+Statements; ComponentLink9URL: https://octopart.com:443/opatz8j6/c1?t=jok27i-MNVRa9Dhq3FL0hwYfwlJRJZZccGuij5R6W92fxOwJKto8gIFTQQU1_Qf6pCH9HzFn8tf5JlfnvOrx4lLu1QsoSLtkIIxLIXTtAKwdNr2p9E3J2ROxr0s_W8Qr-Va1h5kiAcmwp9inFR6XOGv1kB1-MQCQAJLa-fDnp0VPh61KDA8mv_nec21JJPxi_IfFDVqPuUuo0Ry6VAqLNr5ask5fSzhZy12HbVMTxniUTf5vj1O5FvGuPDqI4Z2D1zCs8dIHTLor02t5hL5wcyzORuYLeUu_VOs4HDqlp9_1QiT72dus&src-supplier=Compliance+Statements; ComponentLink9Description: https://octopart.com:443/opatz8j6/c1?t=jok27i-MNVRa9Dhq3FL0hwYfwlJRJZZccGuij5R6W92fxOwJKto8gIFTQQU1_Qf6pCH9HzFn8tf5JlfnvOrx4lLu1QsoSLtkIIxLIXTtAKwdNr2p9E3J2ROxr0s_W8Qr-Va1h5kiAcmwp9inFR6XOGv1kB1-MQCQAJLa-fDnp0VPh61KDA8mv_nec21JJPxi_IfFDVqPuUuo0Ry6VAqLNr5ask5fSzhZy12HbVMTxniUTf5vj1O5FvGuPDqI4Z2D1zCs8dIHTLor02t5hL5wcyzORuYLeUu_VOs4HDqlp9_1QiT72dus&src-supplier=Compliance+Statements; Supplier 1: Newark; Supplier Part Number 1: LT3029EDE#PBF; ComponentLink10URL: https://octopart.com:443/opatz8j6/c1?t=xZc9spvEmlXWbGFw6zM-g55hKd-QdbiqtKjjcrr-w0Kx8hv7C-sfCHjP5KW1KG2fxyCag-HExi8vtK3PezTbE0GiReyOtjb4sG0qETXDXeIHRl3zZg0sJxVE3uBObalYl51sC8EzC0muuJBCAh2veJsRSgJG31bcWWLhWB5JqwrMcO7TvvVCHmppxKw9zvvNA50FdVU0ooSkQ7_CGxTDW0Ur6-GovsRjGthdlqfoONi5pXSBHrtXuuBBzZ7tBYXHWYJRt9IbJmjBzAiN0l2re-ef8YOWJ_vAuDK4kFbMgU64zt7-ScJwCA&src-supplier=Analog+Devices; ComponentLink10Description: https://octopart.com:443/opatz8j6/c1?t=xZc9spvEmlXWbGFw6zM-g55hKd-QdbiqtKjjcrr-w0Kx8hv7C-sfCHjP5KW1KG2fxyCag-HExi8vtK3PezTbE0GiReyOtjb4sG0qETXDXeIHRl3zZg0sJxVE3uBObalYl51sC8EzC0muuJBCAh2veJsRSgJG31bcWWLhWB5JqwrMcO7TvvVCHmppxKw9zvvNA50FdVU0ooSkQ7_CGxTDW0Ur6-GovsRjGthdlqfoONi5pXSBHrtXuuBBzZ7tBYXHWYJRt9IbJmjBzAiN0l2re-ef8YOWJ_vAuDK4kFbMgU64zt7-ScJwCA&src-supplier=Analog+Devices; ComponentLink11URL: https://octopart.com:443/opatz8j6/c1?t=Q6OggpSahTjzGk0DXWHPHtzBqGGwzkBCdT1iEUb96Ul3VEVIEkeXBqS-XliSXzcK4xOGyJN0u4Ev30alFnabA2ZA0p9ngarIAWp9ATXW4zZPhBa4cL-s9-vQ5sKn9vkm9Ic3n7MEBOs7O8MhHApdaXyf5xTkPmFuV920Cuur0SnPm0cNx-4l_zWfRolHdYZfB_mE9tIFp-iWxjd8zNkvBBDh5jz_UJaOBSojPYvpE2JHy43SK-jWlu-vybI5l5NZ4JQ4CYCd4xqtvVZ9B6DNei3fCnAMGaaoGNv7wniK6ES7tiez8MUYZQ&src-supplier=Compliance+Statements; ComponentLink11Description: https://octopart.com:443/opatz8j6/c1?t=Q6OggpSahTjzGk0DXWHPHtzBqGGwzkBCdT1iEUb96Ul3VEVIEkeXBqS-XliSXzcK4xOGyJN0u4Ev30alFnabA2ZA0p9ngarIAWp9ATXW4zZPhBa4cL-s9-vQ5sKn9vkm9Ic3n7MEBOs7O8MhHApdaXyf5xTkPmFuV920Cuur0SnPm0cNx-4l_zWfRolHdYZfB_mE9tIFp-iWxjd8zNkvBBDh5jz_UJaOBSojPYvpE2JHy43SK-jWlu-vybI5l5NZ4JQ4CYCd4xqtvVZ9B6DNei3fCnAMGaaoGNv7wniK6ES7tiez8MUYZQ&src-supplier=Compliance+Statements

## Nets that join several sheets
1V8: Control_Schem (8 pins), PowerSchem (7 pins)
3V3: Control_Schem (41 pins), PowerSchem (8 pins)
6V0: Control_Schem (7 pins), PowerSchem (15 pins)
GND: Control_Schem (74 pins), PowerSchem (32 pins)